# Altium project Summer_Project.PrjPcb
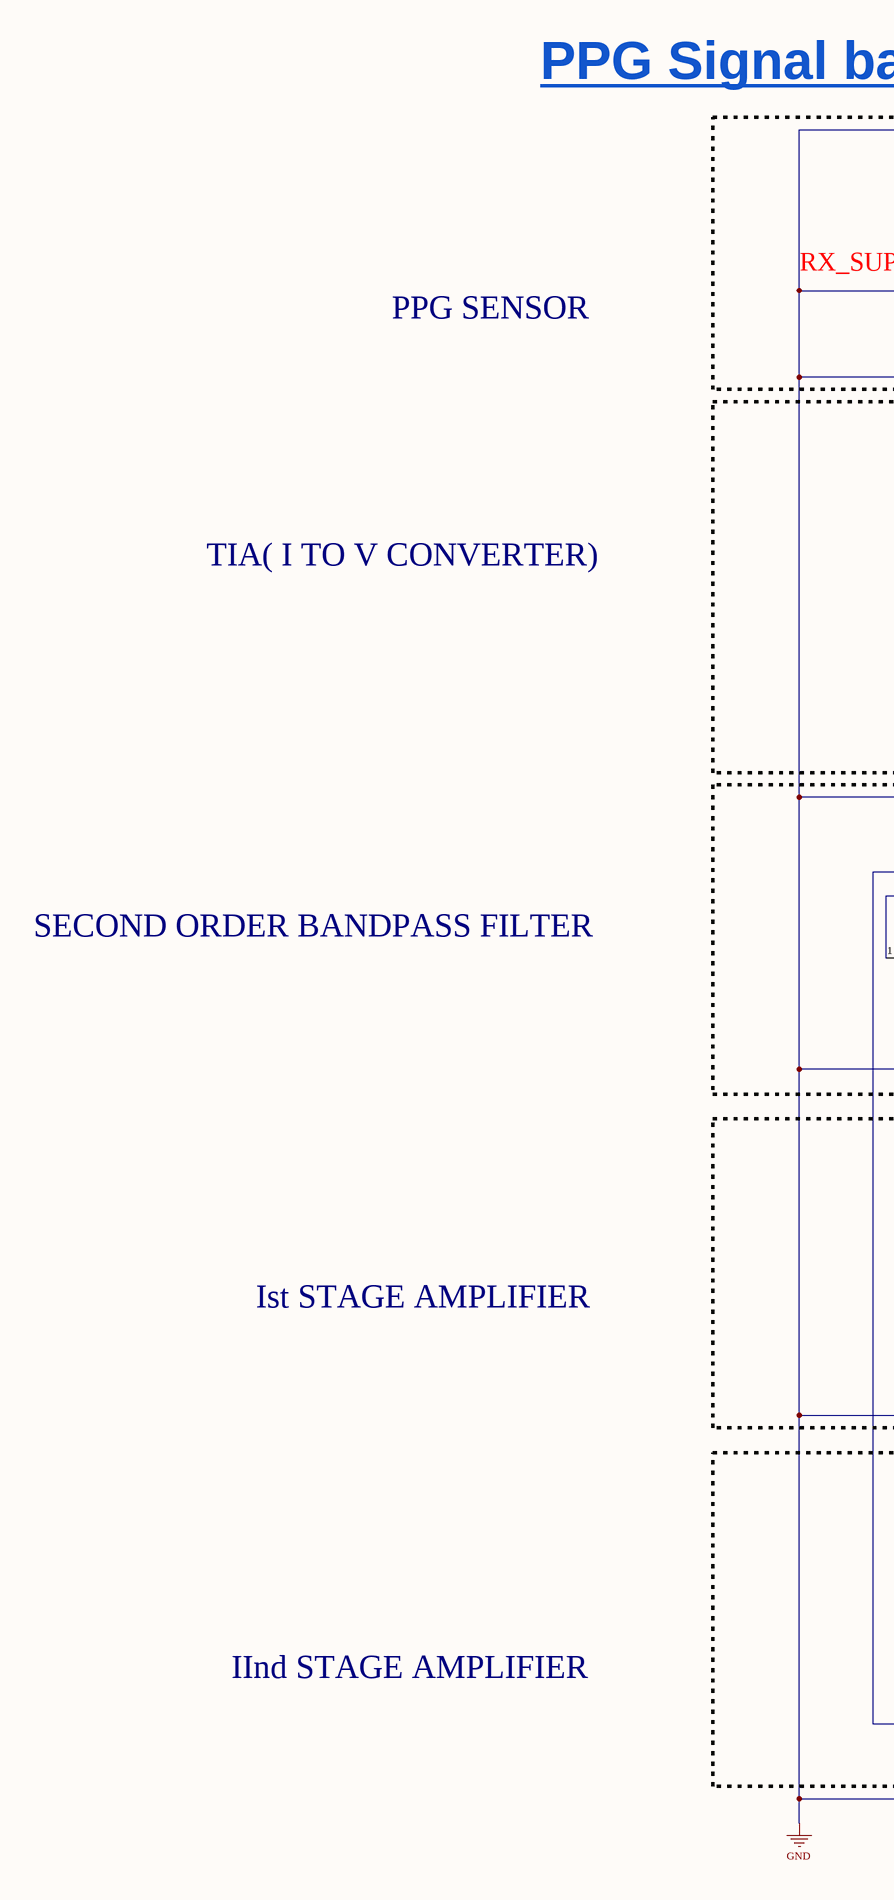
[diagram p0: SENSOR.SchDoc, left]
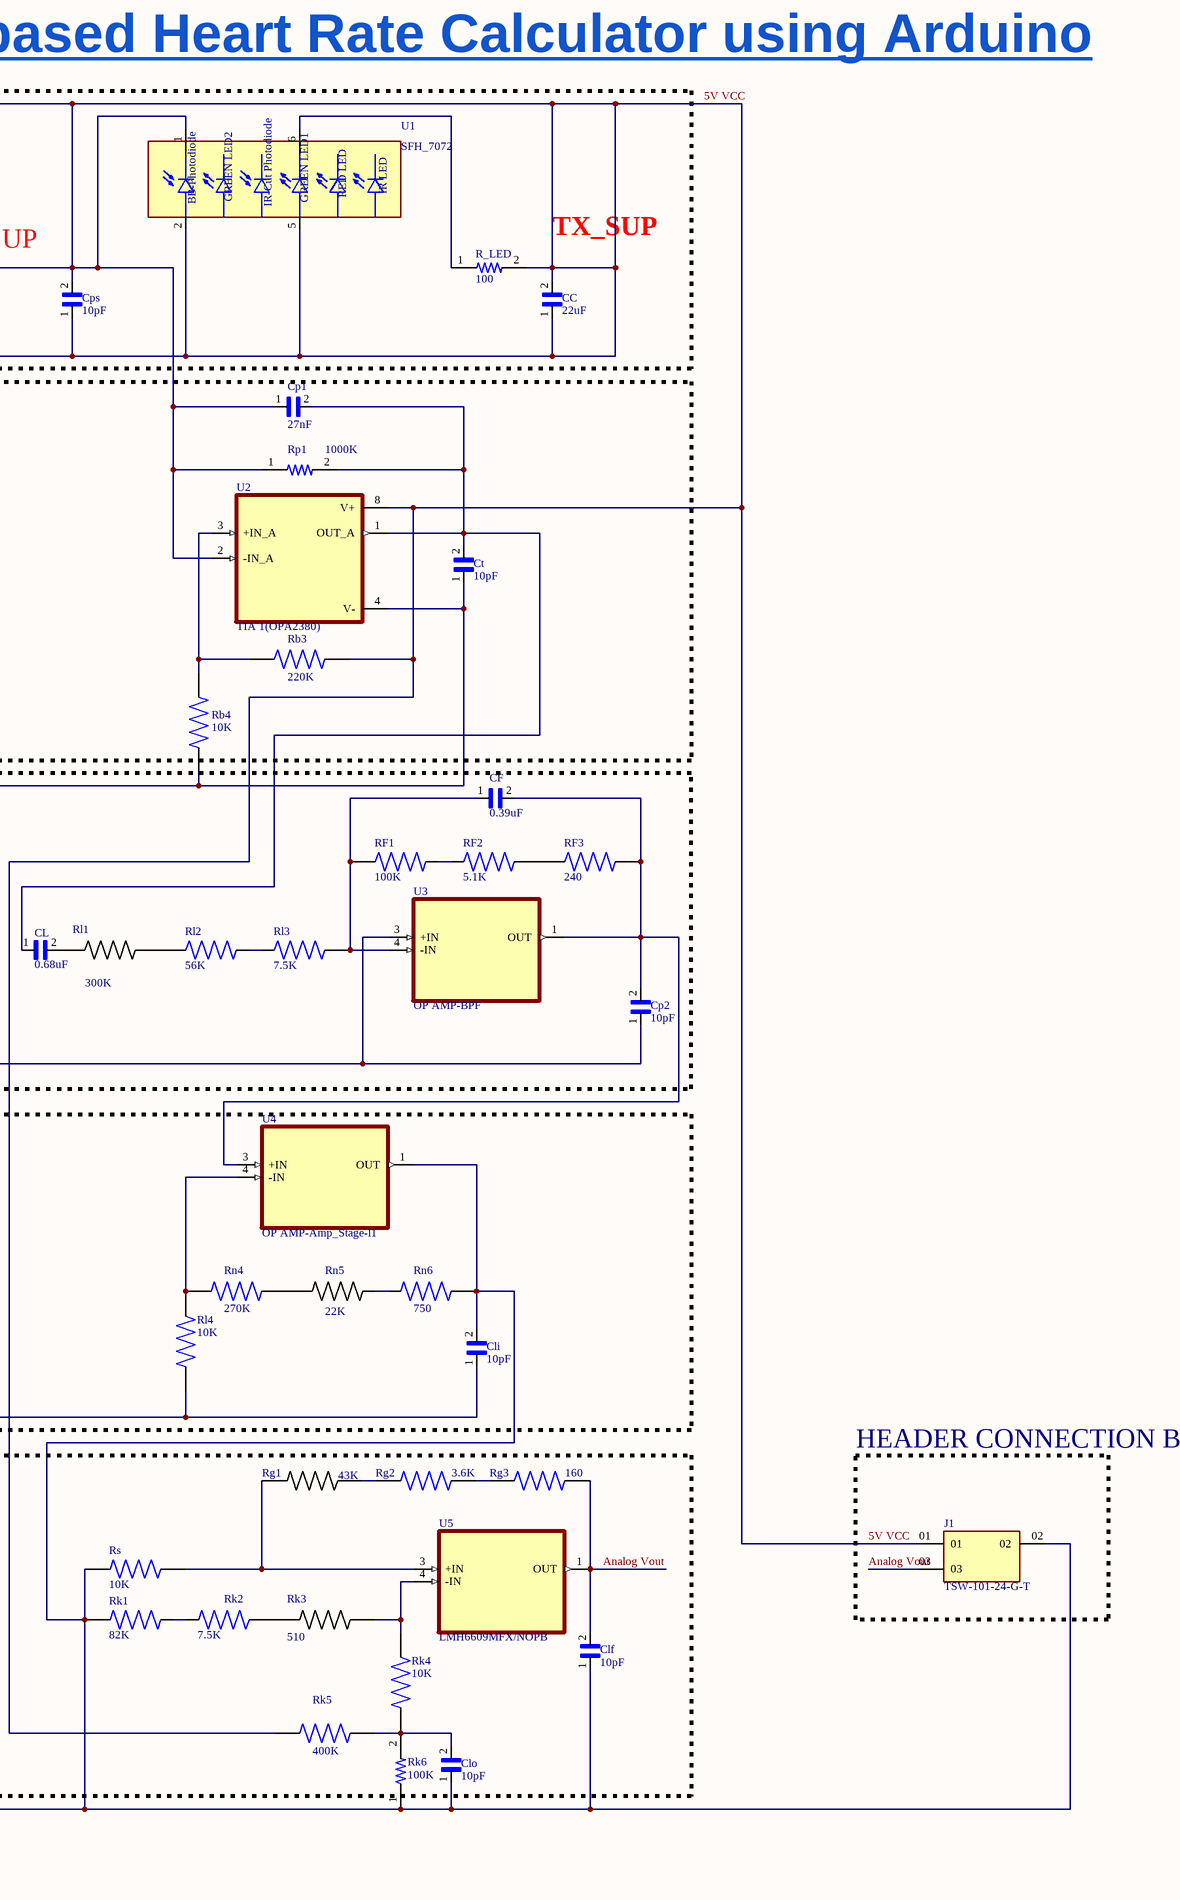
[diagram p1: SENSOR.SchDoc, right]
1 sheet, 40 parts. Net scope: global (net labels, ports and power ports of the same name join across sheets).
Board file: Project.PcbDoc

## Sheet SENSOR.SchDoc
size OrCAD C

### Parts
CC  22uF  [INDC2112X145N]
CF  0.39uF  [CAPC2012X140N]
CL  0.68uF  [CAPC1608X90N]
Clf  10pF  [CAPC1608X90N]
Cli  10pF  [CAPC1608X90N]
Clo  10pF  [CAPC1608X90N]
Cp1  27nF  [CAPC5750X330N]
Cp2  10pF  [CAPC1608X90N]
Cps  10pF  [CAPC1608X90N]
Ct  10pF  [CAPC1608X90N]
J1  TSW-101-24-G-T  [SAMTEC_TSW-101-24-G-T]
R_LED  100  [RESC0603X26N]
Rb3  220K  [RESC1005X40N]
Rb4  10K  [RESC0603X26N]
RF1  100K  [RESC1005X40N]
RF2  5.1K  [RES_ERA3AEB512V]
RF3  240  [RES_ERA2AED241X]
Rg1  43K  [*RES_ERJ1GNF4302C]
Rg2  3.6K  [RESC1005X35N]
Rg3  160  [RESC0603X26N]
Rk1  82K  [RESC1005X40N]
Rk2  7.5K  [RESC1508X50N]
Rk3  510  [*RESC0603X26N]
Rk4  10K  [RESC0603X26N]
Rk5  400K  [RESC2012X50N]
Rk6  100K  [RESC0603X26N]
Rl1  300K  [*RES_ERA3AEB304V]
Rl2  56K  [RESC1005X40N]
Rl3  7.5K  [RESC1508X50N]
Rl4  10K  [RESC0603X26N]
Rn4  270K  [RESC2012X65N]
Rn5  22K  [*RES_ERA2AEB223X]
Rn6  750  [RES_ERA3AEB751V]
Rp1  1000K  [RESC0603X26N]
Rs  10K  [RESC0603X26N]
U1  SFH_7072  [XDCR_SFH_7072]
U2  TIA 1(OPA2380)  [SOP65P490X110-8N]
U3  OP AMP-BPF  [SOT95P280X145-5N]
U4  OP AMP-Amp_Stage-l1  [SOT95P280X145-5N]
U5  LMH6609MFX/NOPB  [SOT95P280X145-5N]

### Blocks framed on the sheet
HEADER CONNECTION B/W ARDUINO AND PCB: J1

### Nets
5V VCC: CC.1 CC.2 Clf.1 Cli.1 Cli.2 Clo.1 Cp1.1 Cp2.1 Cps.1 Cps.2 Ct.1 J1.01 J1.02 R_LED.2 Rb3.2 Rb4.1 Rk1.1 Rk5.1 Rk6.1 Rl4.1 Rn6.2 Rp1.1 Rs.1 U1.1(BPC) U1.2(BPA) U1.5(G1A) U2.2(-IN_A) U2.4(V-) U2.8(V+) U3.3(+IN) U4.1(OUT)  [also labelled GND]
Analog Vout: Clf.2 J1.03 Rg3.2 U5.1(OUT)
NetCF_1: CF.1 RF1.1 Rl3.2 U3.4(-IN)
NetCF_2: CF.2 Cp2.2 RF3.2 U3.1(OUT) U4.3(+IN)
NetCL_1: CL.1 Cp1.2 Ct.2 Rp1.2 U2.1(OUT_A)
NetCL_2: CL.2 Rl1.1
NetClo_2: Clo.2 Rk4.1 Rk5.2 Rk6.2
NetR_LED_1: R_LED.1 U1.6(G1C)
NetRb3_1: Rb3.1 Rb4.2 U2.3(+IN_A)
NetRF1_2: RF1.2 RF2.1
NetRF2_2: RF2.2 RF3.1
NetRg1_1: Rg1.1 Rs.2 U5.3(+IN)
NetRg1_2: Rg1.2 Rg2.1
NetRg2_2: Rg2.2 Rg3.1
NetRk1_2: Rk1.2 Rk2.1
NetRk2_2: Rk2.2 Rk3.1
NetRk3_2: Rk3.2 Rk4.2 U5.4(-IN)
NetRl1_2: Rl1.2 Rl2.1
NetRl2_2: Rl2.2 Rl3.1
NetRl4_2: Rl4.2 Rn4.1 U4.4(-IN)
NetRn4_2: Rn4.2 Rn5.1
NetRn5_2: Rn5.2 Rn6.1

### Notes on the sheet
- PPG Signal based Heart Rate Calculator using Arduino
- RX_SUP
- TX_SUP
- PPG SENSOR
- TIA( I TO V CONVERTER)
- SECOND ORDER BANDPASS FILTER
- Ist STAGE AMPLIFIER
- IInd STAGE AMPLIFIER
- (in symbol SFH_7072) IR LED; RED LED; BB-Photodiode; GREEN LED2; IR-Cut Photodiode; GREEN LED1

### Library data of the parts
CC = LMK212BBJ226MG-T: 22ÂµF Â±20% 10V Ceramic Capacitor X5R 0805 (2012 Metric); MF: Taiyo Yuden; Price: None; Value: *; Package: 0805 Taiyo Yuden; Mouser-Purchase-URL: https://snapeda.com/shop?store=Mouser&id=1756934; Availability: Good; SnapEDA_Link: https://www.snapeda.com/parts/LMK212BBJ226MG-T/Taiyo%20Yuden/view-part/1756934/?ref=snap; MP: LMK212BBJ226MG-T; DigiKey-Purchase-URL: https://snapeda.com/shop?store=DigiKey&id=1756934
CF = 0805YC394JAT2A: 0.39ÂµF Â±5% 16V Ceramic Capacitor X7R 0805 _2012 Metric_; MF: AVX; Package: 2012 AVX; Digi-Key_Part_Number: 478-10574-2-ND; Value: *; MP: 0805YC394JAT2A; SnapEDA_Link: https://www.snapeda.com/parts/0805YC394JAT2A/AVX/view-part/606850/?ref=snap; Digi-Key_Purchase_URL: https://www.digikey.com/product-detail/en/avx-corporation/0805YC394JAT2A/478-10574-2-ND/1603316?utm_source=snapeda&utm_medium=aggregator&utm_campaign=symbol
CL = C1608X7R1C684K080AC: Multilayer Ceramic Capacitor, C Series, 0.68 - F, - 10%, X7R, 16 V, 0603 [1608 Metric]; Package: None; Price: None; Value: *; MP: C1608X7R1C684K080AC; Availability: Unavailable
Clf Cli Clo Cp2 Cps Ct = 06035A100JAT2A: 10PF 5% 50V C0G 0603; Package: None; Price: None; Value: *; MP: 06035A100JAT2A; Availability: Unavailable
Cp1 = 06033C104KAT4A: 2220GC273KAT1A; MF: AVX; Package: 1608 AVX; Digi-Key_Part_Number: 478-7018-1-ND; SnapEDA_Link: https://www.snapeda.com/parts/06033C104KAT4A/AVX/view-part/1797095/?ref=snap; Value: *; Digi-Key_Purchase_URL: https://www.digikey.com/product-detail/en/avx-corporation/06033C104KAT4A/478-7018-1-ND/3247565?utm_source=snapeda&utm_medium=aggregator&utm_campaign=symbol; MP: 06033C104KAT4A
J1 = TSW-101-24-G-T: Connector Header Through Hole 3 position; MF: Samtec; Availability: Bad; SnapEDA_Link: https://www.snapeda.com/parts/TSW-101-24-G-T/Samtec/view-part/3380371/?ref=snap; Price: None; Check_prices: https://www.snapeda.com/parts/TSW-101-24-G-T/Samtec/view-part/3380371/?ref=eda; Package: None; MP: TSW-101-24-G-T; Purchase-URL: https://pricing.snapeda.com/search/part/TSW-101-24-G-T/?ref=eda; Value: *
R_LED = RC0201FR-07100RL: 100 Ohms Â±1% 0.05W, 1/20W Chip Resistor 0201 _0603 Metric_ Moisture Resistant Thick Film; MF: Yageo; Value: *; SnapEDA_Link: https://www.snapeda.com/parts/RC0201FR-07100RL/Yageo/view-part/938913/?ref=snap; Package: 0201 Yageo; MP: RC0201FR-07100RL; Digi-Key_Part_Number: 311-100MCT-ND
Rb3 = CRGCQ0402F220K: Fixed Resistor CRGCQ 0402 220K 1%; Package: None; Price: None; Value: *; MP: CRGCQ0402F220K; Availability: Unavailable
Rb4 Rk4 Rl4 Rs = RMCF0201FT10K0: 10 kOhms Â±1% 0.05W, 1/20W Chip Resistor 0201 (0603 Metric) Thick Film; MF: Stackpole Electronics Inc; Package: 0603 Rohm Semiconductor; SnapEDA_Link: https://www.snapeda.com/parts/RMCF0201FT10K0/Stackpole%20Electronics%20Inc/view-part/3959982/?ref=snap; MP: RMCF0201FT10K0; Purchase-URL: https://pricing.snapeda.com/search/part/RMCF0201FT10K0/?ref=eda; Price: None; Value: *; Availability: Good
RF1 = RR0510P-104-D: RES, THIN FILM, 100K, 0.5%, 0.063W, 0402, REEL; Package: None; Price: None; Value: *; MP: RR0510P-104-D; Availability: Unavailable
RF2 = ERA3AEB512V: 5.1 kOhms 0.1% 0.1W, 1/10W Chip Resistor 0603 (1608 Metric) Automotive AEC-Q200 Thin Film; MF: Panasonic; MP: ERA-3AEB512V; Check_prices: https://www.snapeda.com/parts/ERA-3AEB512V/Panasonic%20Electronic%20Components/view-part/329488/?ref=eda; SnapEDA_Link: https://www.snapeda.com/parts/ERA-3AEB512V/Panasonic%20Electronic%20Components/view-part/329488/?ref=snap; Price: None; Availability: In Stock; Package: 1608-2 Panasonic; Value: *
RF3 = ERA2AED241X: 240 Ohms 0.5% 0.063W, 1/16W Chip Resistor 0402 (1005 Metric) Automotive AEC-Q200 Thin Film; MF: Panasonic; MP: ERA-2AED241X; Check_prices: https://www.snapeda.com/parts/ERA-2AED241X/Panasonic/view-part/3718380/?ref=eda; SnapEDA_Link: https://www.snapeda.com/parts/ERA-2AED241X/Panasonic/view-part/3718380/?ref=snap; Price: None; Availability: In Stock; Package: 1005-2 Panasonic; Value: *
Rg1 = ERJ1GNF4302C: None; MF: Panasonic; MP: ERJ1GNF4302C; Package: None; Price: None; Availability: Unavailable; Value: *
Rg2 = RMCF0402FT3K60: Package: None; Price: None; Value: *; MP: RMCF0402FT3K60; Availability: Unavailable
Rg3 = RC0201FR-07160RL: Res Thick Film 0201 160 Ohm 1% 0.05W(1/20W) Â±200ppm/Â°C Pad SMD T/R; MF: Yageo; MP: RC0201FR-07160RL; Package: 0603 Rohm Semiconductor; SnapEDA_Link: https://www.snapeda.com/parts/RC0201FR-07160RL/Yageo/view-part/967070/?ref=snap; Price: None; Availability: In Stock; Value: *; Check_prices: https://www.snapeda.com/parts/RC0201FR-07160RL/Yageo/view-part/967070/?ref=eda
Rk1 = CRGCQ0402F82K: Fixed Resistor CRGCQ 0402 82K 1%; Package: None; Price: None; Value: *; MP: CRGCQ0402F82K; Availability: Unavailable
Rk2 Rl3 = RNCP0603FTD7K50: Package: None; Price: None; Value: *; MP: RNCP0603FTD7K50; Availability: Unavailable
Rk3 = RC0201FR-07510RL: SnapEDA_Link: https://www.snapeda.com/parts/RC0201FR-07510RL/Yageo/view-part/938189/?ref=snap; Check_prices: https://www.snapeda.com/parts/RC0201FR-07510RL/Yageo/view-part/938189/?ref=eda; Value: *
Rk5 = CRCW0805400KJNTA: Package: None; Price: None; Value: *; MP: CRCW0805400KJNTA; Availability: Unavailable
Rk6 = RC0201JR-07100KL: 100 kOhms Â±5% 0.05W, 1/20W Chip Resistor 0201 _0603 Metric_ Moisture Resistant Thick Film; MF: Yageo; Digi-Key_Part_Number: 311-100KNCT-ND; SnapEDA_Link: https://www.snapeda.com/parts/RC0201JR-07100KL/Yageo/view-part/2509071/?ref=snap; MP: RC0201JR-07100KL; Package: 0201 Yageo; Value: *; Digi-Key_Purchase_URL: https://www.digikey.com/product-detail/en/yageo/RC0201JR-07100KL/311-100KNCT-ND/1949005?utm_source=snapeda&utm_medium=aggregator&utm_campaign=symbol
Rl1 = ERA3AEB304V: Check_prices: https://www.snapeda.com/parts/ERA-3AEB304V/Panasonic%20Electronic%20Components/view-part/329732/?ref=eda; SnapEDA_Link: https://www.snapeda.com/parts/ERA-3AEB304V/Panasonic%20Electronic%20Components/view-part/329732/?ref=snap; Value: *
Rl2 = CRGCQ0402F56K: Fixed Resistor CRGCQ 0402 56K 1%; Package: None; Price: None; Value: *; MP: CRGCQ0402F56K; Availability: Unavailable
Rn4 = CRG0805F270K: CRG0805 1% 270K; Package: None; Price: None; Value: *; MP: CRG0805F270K; Availability: Unavailable
Rn5 = ERA2AEB223X: Check_prices: https://www.snapeda.com/parts/ERA-2AEB223X/Panasonic%20Electronic%20Components/view-part/274489/?ref=eda; SnapEDA_Link: https://www.snapeda.com/parts/ERA-2AEB223X/Panasonic%20Electronic%20Components/view-part/274489/?ref=snap; Value: *
Rn6 = ERA3AEB751V: 750 Ohms 0.1% 0.1W, 1/10W Chip Resistor 0603 (1608 Metric) Automotive AEC-Q200 Thin Film; MP: ERA-3AEB751V; MF: Panasonic; Package: 1608-2 Panasonic; Price: None; Availability: In Stock; Check_prices: https://www.snapeda.com/parts/ERA-3AEB751V/Panasonic%20Electronic%20Components/view-part/329191/?ref=eda; SnapEDA_Link: https://www.snapeda.com/parts/ERA-3AEB751V/Panasonic%20Electronic%20Components/view-part/329191/?ref=snap; Value: *
Rp1 = RC0201FR-071ML: 1 MOhms Â±1% 0.05W, 1/20W Chip Resistor 0201 (0603 Metric) Moisture Resistant Thick Film; MF: Yageo; MP: RC0201FR-071ML; Price: None; Availability: Good; SnapEDA_Link: https://www.snapeda.com/parts/RC0201FR-071ML/Yageo/view-part/629704/?ref=snap; Arrow_Electronics-Purchase-URL: https://snapeda.com/shop?store=Arrow+Electronics&id=629704; Value: *; Mouser-Purchase-URL: https://snapeda.com/shop?store=Mouser&id=629704; Package: 0201 Yageo; DigiKey-Purchase-URL: https://snapeda.com/shop?store=DigiKey&id=629704
U1 = SFH_7072: Reflective Optical Sensor 6-SMD, No Lead; MF: OSRAM Opto; Price: None; Availability: Unavailable; Value: *; MP: SFH 7072; SnapEDA_Link: https://www.snapeda.com/parts/SFH%207072/OSRAM%20Opto%20Semiconductors%20Inc./view-part/2464223/?ref=snap; Package: SMD-6 Osram Opto
U2 = OPA2380AIDGKT: Package: None; Price: None; Value: *; MP: OPA2380AIDGKT; Availability: Unavailable
U3 U4 = LMH6609MFX/NOPB: Package: None; Price: None; Value: *; MP: LMH6609MFX/NOPB; Availability: Unavailable
U5 = LMH6609MFX/NOPB: Package: None; Price: None; Value: *; MP: LMH6609MFX/NOPB; Availability: Unavailable